# EAGLE design PowerSupply (EAGLE 6.5.0)
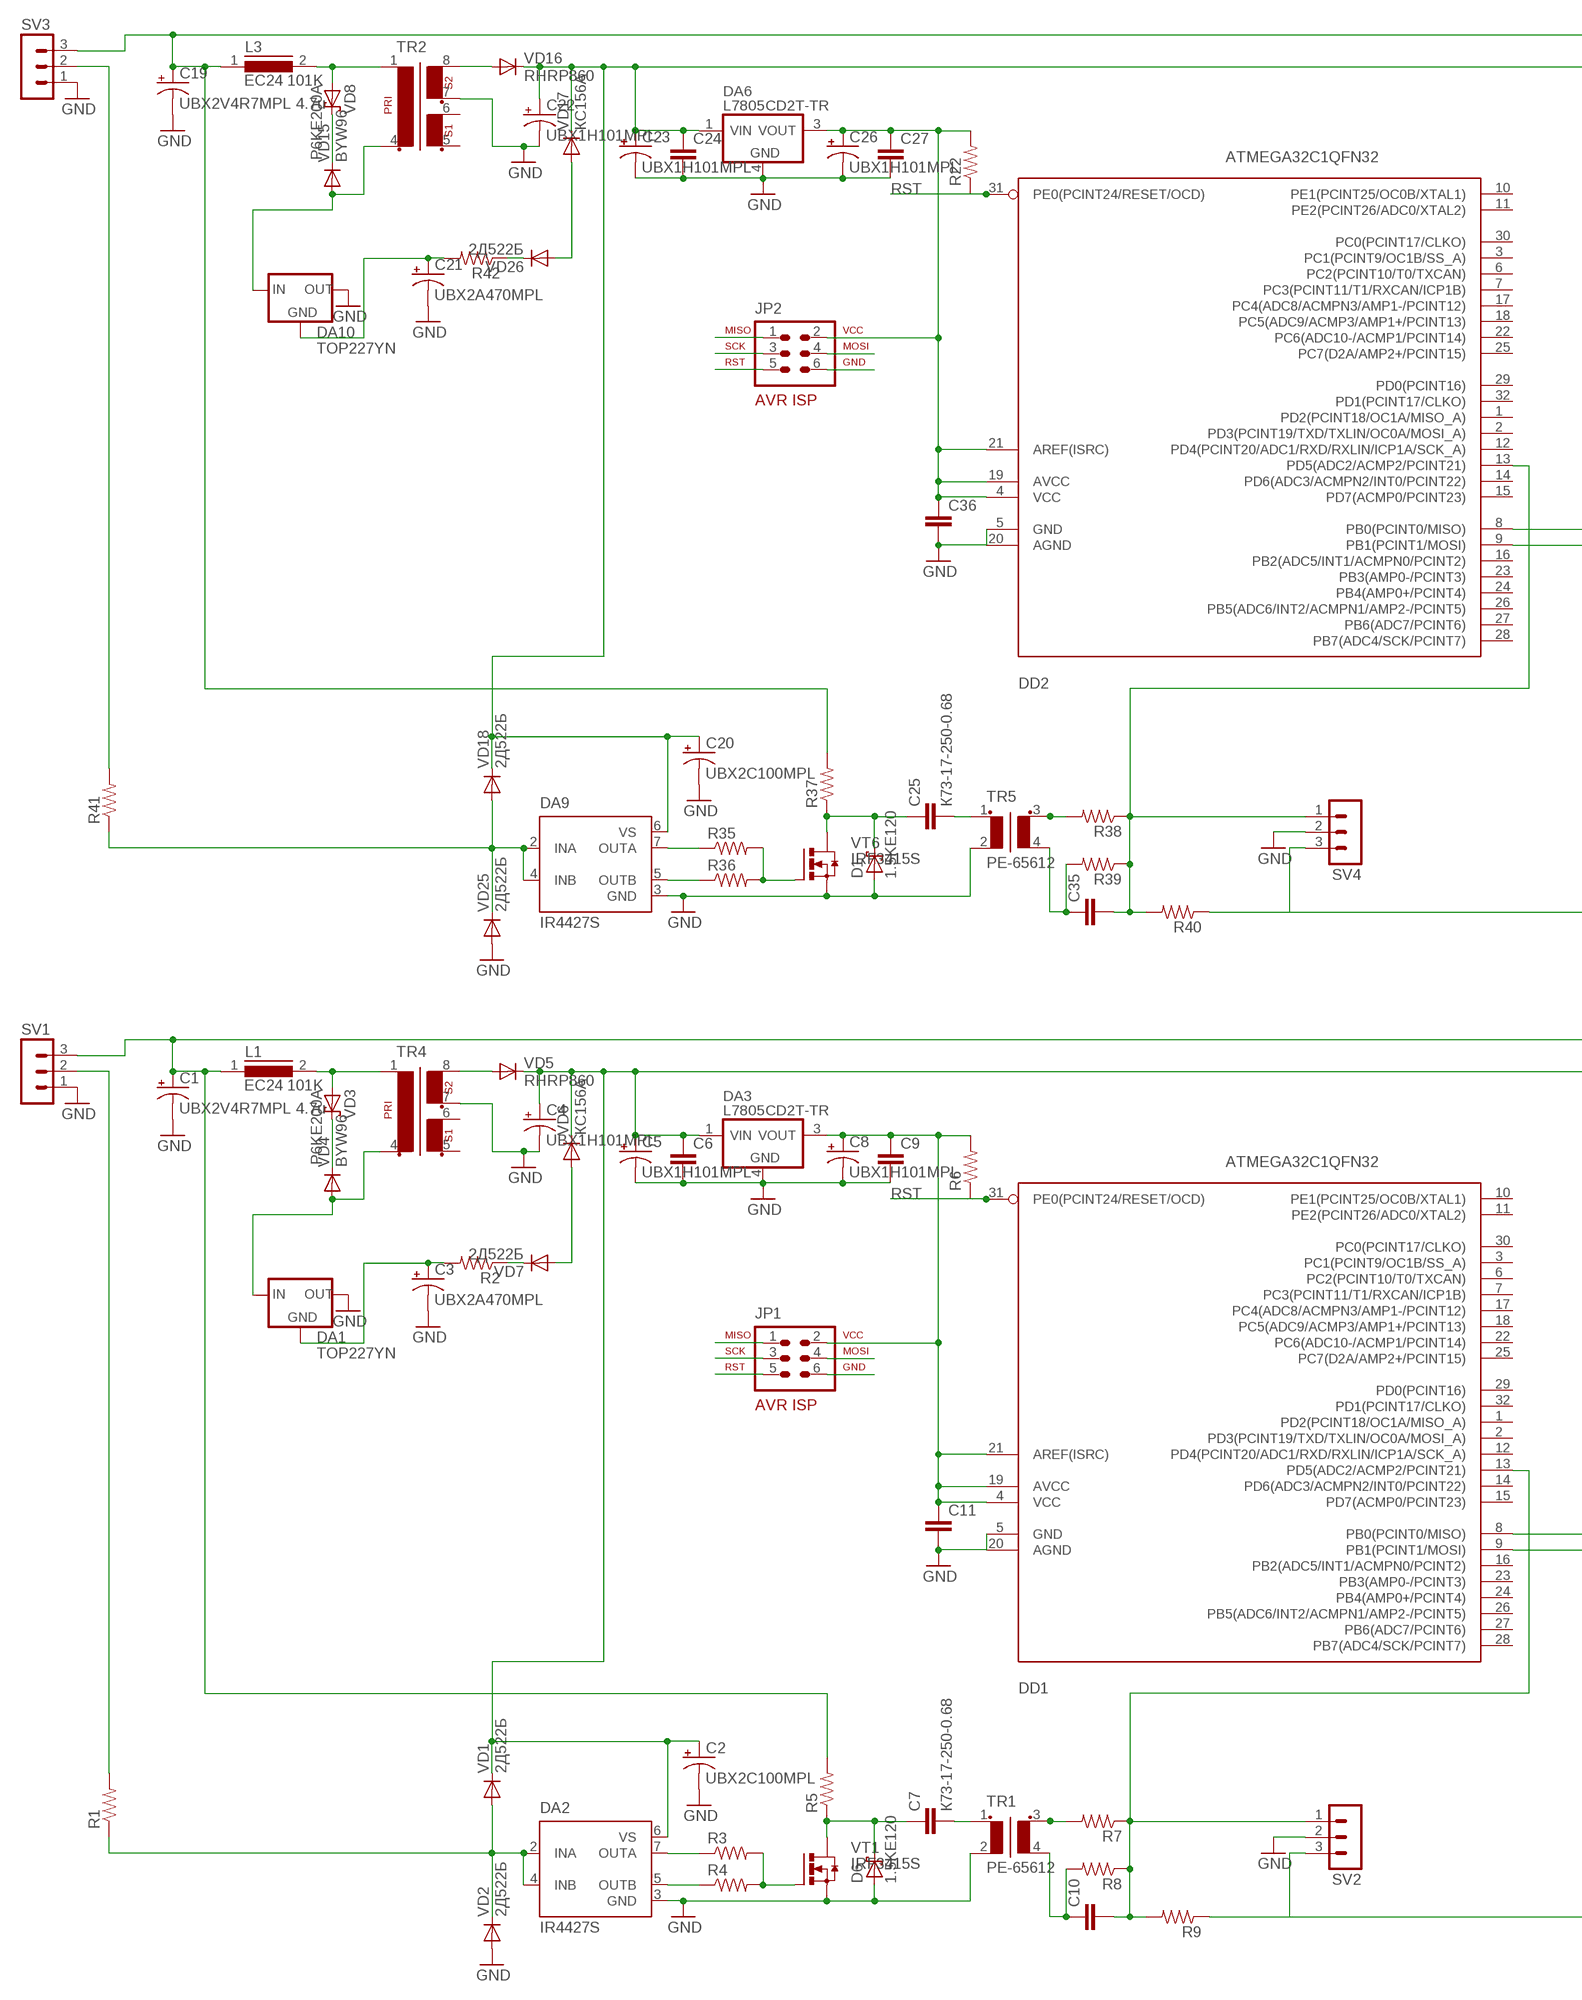
[diagram p0: schematic, sheet 1, part 1 of 2]
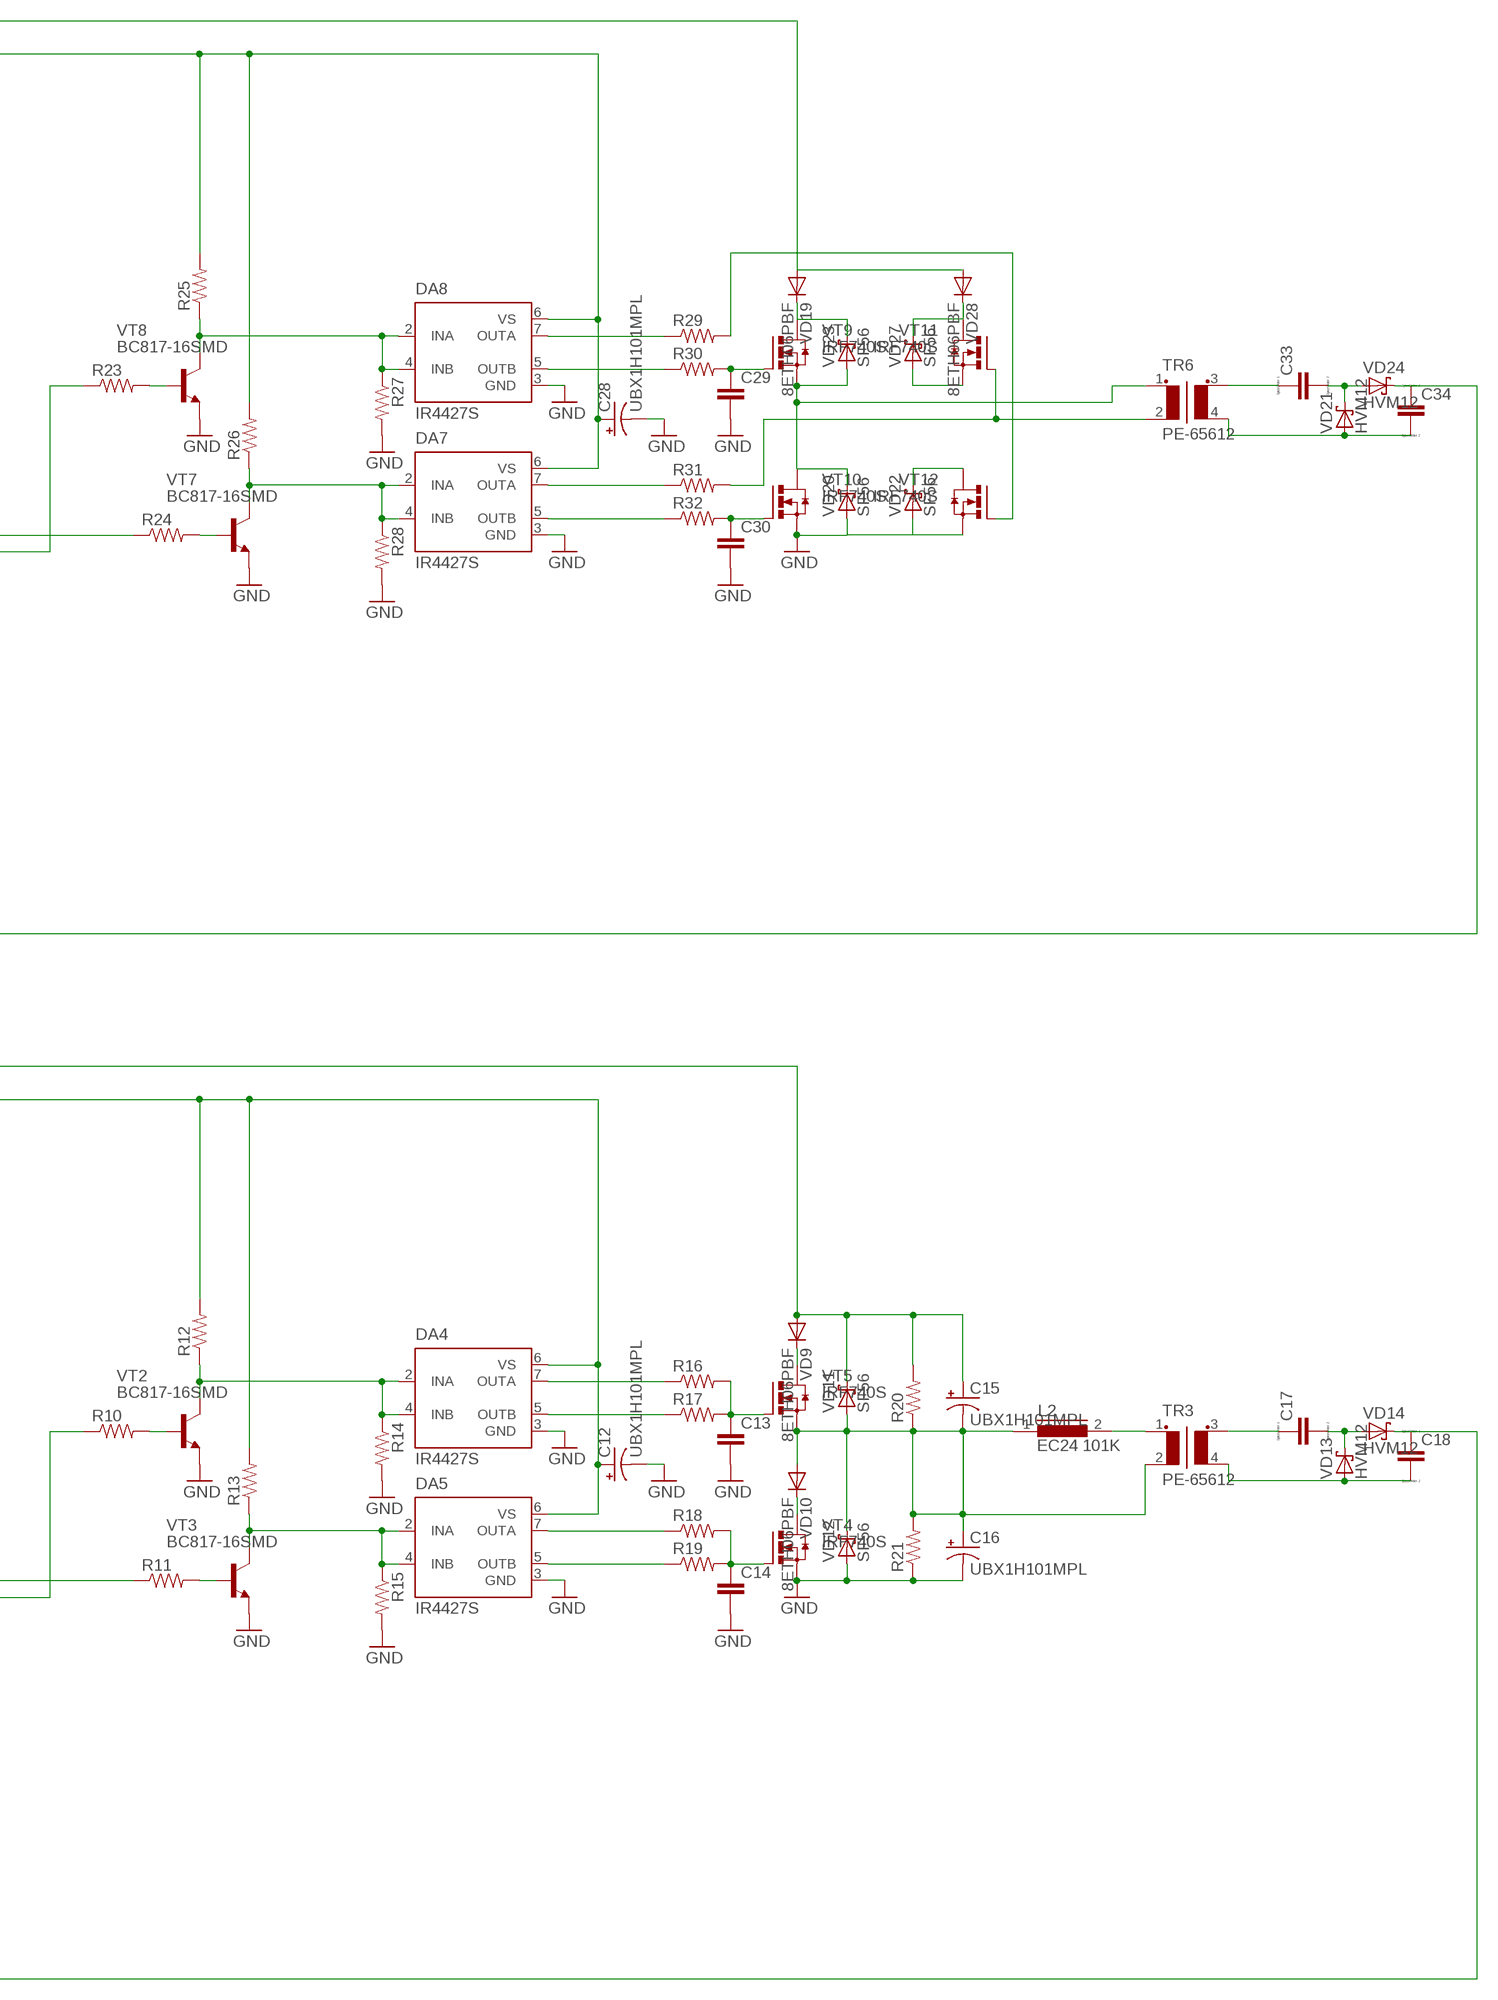
[diagram p1: schematic, sheet 1, part 2 of 2]

## Parts
C1  UBX2V4R7MPL 4.7u  CAP_POLPTH1  [CPOL-RADIAL-100UF-25V]
C2  UBX2C100MPL  CAP_POLPTH1  [CPOL-RADIAL-100UF-25V]
C3  UBX2A470MPL  CAP_POLPTH1  [CPOL-RADIAL-100UF-25V]
C4  UBX1H101MPL  CAP_POLPTH1  [CPOL-RADIAL-100UF-25V]
C5  UBX1H101MPL  CAP_POLPTH1  [CPOL-RADIAL-100UF-25V]
C6  CAP1206  [1206]
C7  К73-17-250-0.68  CAPPTH3  [CAP-PTH-LARGE]
C8  UBX1H101MPL  CAP_POLPTH1  [CPOL-RADIAL-100UF-25V]
C9  CAP1206  [1206]
C10  CAP1206  [1206]
C11  CAP1206  [1206]
C12  UBX1H101MPL  CAP_POLPTH1  [CPOL-RADIAL-100UF-25V]
C13  CAP1206  [1206]
C14  CAP1206  [1206]
C15  UBX1H101MPL  CAP_POLPTH1  [CPOL-RADIAL-100UF-25V]
C16  UBX1H101MPL  CAP_POLPTH1  [CPOL-RADIAL-100UF-25V]
C17  CC1812  [C1812]
C18  CC1812  [C1812]
C19  UBX2V4R7MPL 4.7u  CAP_POLPTH1  [CPOL-RADIAL-100UF-25V]
C20  UBX2C100MPL  CAP_POLPTH1  [CPOL-RADIAL-100UF-25V]
C21  UBX2A470MPL  CAP_POLPTH1  [CPOL-RADIAL-100UF-25V]
C22  UBX1H101MPL  CAP_POLPTH1  [CPOL-RADIAL-100UF-25V]
C23  UBX1H101MPL  CAP_POLPTH1  [CPOL-RADIAL-100UF-25V]
C24  CAP1206  [1206]
C25  К73-17-250-0.68  CAPPTH3  [CAP-PTH-LARGE]
C26  UBX1H101MPL  CAP_POLPTH1  [CPOL-RADIAL-100UF-25V]
C27  CAP1206  [1206]
C28  UBX1H101MPL  CAP_POLPTH1  [CPOL-RADIAL-100UF-25V]
C29  CAP1206  [1206]
C30  CAP1206  [1206]
C33  CC1812  [C1812]
C34  CC1812  [C1812]
C35  CAP1206  [1206]
C36  CAP1206  [1206]
D1  1.5KE120  P6KEXX  [CB417-15]
D6  1.5KE120  P6KEXX  [CB417-15]
DA1  TOP227YN  LM1086TO220V  [TO220S]
DA2  IR4427S  [SO08]
DA3  L7805CD2T-TR  MC7805D2T  [D2PAK-3]
DA4  IR4427S  [SO08]
DA5  IR4427S  [SO08]
DA6  L7805CD2T-TR  MC7805D2T  [D2PAK-3]
DA7  IR4427S  [SO08]
DA8  IR4427S  [SO08]
DA9  IR4427S  [SO08]
DA10  TOP227YN  LM1086TO220V  [TO220S]
DD1  ATMEGA32C1QFN32  [QFN32]
DD2  ATMEGA32C1QFN32  [QFN32]
JP1  AVR-ISP-6VERT  [AVR-ISP-6]
JP2  AVR-ISP-6VERT  [AVR-ISP-6]
L1  EC24 101K  MMICC7  [MMICC7]
L2  EC24 101K  MMICC7  [MMICC7]
L3  EC24 101K  MMICC7  [MMICC7]
R1  RESISTOR1206  [1206]
R2  RESISTOR1206  [1206]
R3  RESISTOR1206  [1206]
R4  RESISTOR1206  [1206]
R5  RESISTOR1206  [1206]
R6  RESISTOR1206  [1206]
R7  RESISTOR1206  [1206]
R8  RESISTOR1206  [1206]
R9  RESISTOR1206  [1206]
R10  RESISTOR1206  [1206]
R11  RESISTOR1206  [1206]
R12  RESISTOR1206  [1206]
R13  RESISTOR1206  [1206]
R14  RESISTOR1206  [1206]
R15  RESISTOR1206  [1206]
R16  RESISTOR1206  [1206]
R17  RESISTOR1206  [1206]
R18  RESISTOR1206  [1206]
R19  RESISTOR1206  [1206]
R20  RESISTOR1206  [1206]
R21  RESISTOR1206  [1206]
R22  RESISTOR1206  [1206]
R23  RESISTOR1206  [1206]
R24  RESISTOR1206  [1206]
R25  RESISTOR1206  [1206]
R26  RESISTOR1206  [1206]
R27  RESISTOR1206  [1206]
R28  RESISTOR1206  [1206]
R29  RESISTOR1206  [1206]
R30  RESISTOR1206  [1206]
R31  RESISTOR1206  [1206]
R32  RESISTOR1206  [1206]
R35  RESISTOR1206  [1206]
R36  RESISTOR1206  [1206]
R37  RESISTOR1206  [1206]
R38  RESISTOR1206  [1206]
R39  RESISTOR1206  [1206]
R40  RESISTOR1206  [1206]
R41  RESISTOR1206  [1206]
R42  RESISTOR1206  [1206]
SV1  MA03-1  [MA03-1]
SV2  MA03-1  [MA03-1]
SV3  MA03-1  [MA03-1]
SV4  MA03-1  [MA03-1]
TR1  PE-65612  [PE-65612]
TR2  EE20-2  [EE20-2]
TR3  PE-65612  [PE-65612]
TR4  EE20-2  [EE20-2]
TR5  PE-65612  [PE-65612]
TR6  PE-65612  [PE-65612]
VD1  2Д522Б  1N4446  [DO35-10]
VD2  2Д522Б  1N4446  [DO35-10]
VD3  P6KE200A  P6KEXX  [CB417-15]
VD4  BYW96  [SOD64-10]
VD5  RHRP860  DIODE-TO220V  [TO220ACS]
VD6  КС156А  1N4446  [DO35-10]
VD7  2Д522Б  1N4446  [DO35-10]
VD8  P6KE200A  P6KEXX  [CB417-15]
VD9  8ETH06PBF  DIODE-TO220V  [TO220ACS]
VD10  8ETH06PBF  DIODE-TO220V  [TO220ACS]
VD11  SF56  P6KEXX  [CB417-15]
VD12  SF56  P6KEXX  [CB417-15]
VD13  HVM12  P6KEXX  [CB417-15]
VD14  HVM12  P6KEXX  [CB417-15]
VD15  BYW96  [SOD64-10]
VD16  RHRP860  DIODE-TO220V  [TO220ACS]
VD17  КС156А  1N4446  [DO35-10]
VD18  2Д522Б  1N4446  [DO35-10]
VD19  8ETH06PBF  DIODE-TO220V  [TO220ACS]
VD20  SF56  P6KEXX  [CB417-15]
VD21  HVM12  P6KEXX  [CB417-15]
VD22  SF56  P6KEXX  [CB417-15]
VD23  SF56  P6KEXX  [CB417-15]
VD24  HVM12  P6KEXX  [CB417-15]
VD25  2Д522Б  1N4446  [DO35-10]
VD26  2Д522Б  1N4446  [DO35-10]
VD27  SF56  P6KEXX  [CB417-15]
VD28  8ETH06PBF  DIODE-TO220V  [TO220ACS]
VT1  IRF3415S  IRF3704S  [D2PACK]
VT2  BC817-16SMD  [SOT23-BEC]
VT3  BC817-16SMD  [SOT23-BEC]
VT4  IRF740S  IRF3704S  [D2PACK]
VT5  IRF740S  IRF3704S  [D2PACK]
VT6  IRF3415S  IRF3704S  [D2PACK]
VT7  BC817-16SMD  [SOT23-BEC]
VT8  BC817-16SMD  [SOT23-BEC]
VT9  IRF740S  IRF3704S  [D2PACK]
VT10  IRF740S  IRF3704S  [D2PACK]
VT11  IRF740S  IRF3704S  [D2PACK]
VT12  IRF740S  IRF3704S  [D2PACK]

## Nets
GND: C1.2(-) C2.2(-) C3.2(-) C4.2(-) C5.2(-) C6.2 C8.2(-) C9.2 C11.2 C12.2(-) C13.2 C14.2 C16.2(-) C19.2(-) C20.2(-) C21.2(-) C22.2(-) C23.2(-) C24.2 C26.2(-) C27.2 C28.2(-) C29.2 C30.2 C36.2 D1.A D6.A DA1.2(OUT) DA2.3(GND) DA3.4(GND) DA4.3(GND) DA5.3(GND) DA6.4(GND) DA7.3(GND) DA8.3(GND) DA9.3(GND) DA10.2(OUT) DD1.5(GND) DD1.20(AGND) DD2.5(GND) DD2.20(AGND) JP1.6 JP2.6 R14.2 R15.2 R21.1 R27.2 R28.2 SV1.1 SV2.2 SV3.1 SV4.2 TR1.2 TR2.7 TR4.7 TR5.2 VD2.A VD12.A VD20.A VD22.A VD25.A VT1.3(S) VT2.E VT3.E VT4.3(S) VT6.3(S) VT7.E VT8.E VT10.3(S) VT12.3(S)
MISO: DD1.8(PB0(PCINT0/MISO)) JP1.1 R11.1
MISO1: DD2.8(PB0(PCINT0/MISO)) JP2.1 R24.1
MOSI: DD1.9(PB1(PCINT1/MOSI)) JP1.4 R10.1
MOSI1: DD2.9(PB1(PCINT1/MOSI)) JP2.4 R23.1
N$1: TR4.8 VD5.A
N$2: TR2.8 VD16.A
N$3: DA5.2(INA) DA5.4(INB) R13.1 R15.1 VT3.C
N$4: DA4.2(INA) DA4.4(INB) R12.1 R14.1 VT2.C
N$5: C17.2 VD13.C VD14.A
N$6: C18.1 R9.1 SV2.3 VD14.C
N$7: R10.2 VT2.B
N$8: R11.2 VT3.B
N$9: DA5.7(OUTA) R18.1
N$10: DA5.5(OUTB) R19.1
N$11: DA4.5(OUTB) R17.1
N$12: DA4.7(OUTA) R16.1
N$13: C14.1 R18.2 R19.2 VT4.1(G)
N$14: C13.1 R16.2 R17.2 VT5.1(G)
N$15: C18.2 TR3.4(S2) VD13.A
N$16: C17.1 TR3.3(S1)
N$17: VD9.C VT5.2(D)
N$18: DA1.3(IN) TR4.4 VD4.A
N$19: DA2.5(OUTB) R4.1
N$20: C15.2(-) C16.1(+) L2.1 R20.1 R21.2 TR3.2 VD10.A VD11.A VD12.C VT5.3(S)
N$21: L2.2 TR3.1
N$22: VD10.C VT4.2(D)
N$23: DA2.7(OUTA) R3.1
N$24: DA7.2(INA) DA7.4(INB) R26.1 R28.1 VT7.C
N$25: DA8.2(INA) DA8.4(INB) R25.1 R27.1 VT8.C
N$26: R3.2 R4.2 VT1.1(G)
N$27: R2.1 VD7.C
N$28: C2.1(+) C4.1(+) C5.1(+) C6.1 C12.1(+) DA2.6(VS) DA3.1(VIN) DA4.6(VS) DA5.6(VS) R12.2 R13.2 VD1.C VD5.C VD6.C
N$29: DA2.2(INA) DA2.4(INB) R1.1 VD1.A VD2.C
N$30: C7.1 D6.C R5.1 VT1.2(D)
N$31: C10.1 R8.2 TR1.4(S2)
N$32: C7.2 TR1.1
N$33: R7.2 TR1.3(S1)
N$34: C10.2 DD1.13(PD5(ADC2/ACMP2/PCINT21)) R7.1 R8.1 R9.2 SV2.1
N$35: C3.1(+) DA1.1(GND) R2.2
N$36: R1.2 SV1.2
N$37: L1.2 TR4.1 VD3.A
N$38: VD3.C VD4.C
N$39: C1.1(+) C15.1(+) L1.1 R5.2 R20.2 SV1.3 VD9.A VD11.C
N$40: R23.2 VT8.B
N$41: VD6.A VD7.A
N$42: R24.2 VT7.B
N$43: DA7.7(OUTA) R31.1
N$44: DA7.5(OUTB) R32.1
N$45: DA8.5(OUTB) R30.1
N$46: DA8.7(OUTA) R29.1
N$47: C30.1 R32.2 VT10.1(G)
N$48: C29.1 R30.2 VT9.1(G)
N$49: C33.2 VD21.C VD24.A
N$50: C34.1 R40.1 SV4.3 VD24.C
N$51: C34.2 TR6.4(S2) VD21.A
N$52: C33.1 TR6.3(S1)
N$54: TR6.1 VD20.C VD23.A VT9.3(S) VT10.2(D)
N$56: VD19.C VD23.C VT9.2(D)
N$57: C20.1(+) C22.1(+) C23.1(+) C24.1 C28.1(+) DA6.1(VIN) DA7.6(VS) DA8.6(VS) DA9.6(VS) R25.2 R26.2 VD16.C VD17.C VD18.C
N$58: DA9.2(INA) DA9.4(INB) R41.1 VD18.A VD25.C
N$59: DA9.5(OUTB) R36.1
N$60: DA9.7(OUTA) R35.1
N$61: R35.2 R36.2 VT6.1(G)
N$62: C25.1 D1.C R37.1 VT6.2(D)
N$63: C35.1 R39.2 TR5.4(S2)
N$64: C25.2 TR5.1
N$65: R38.2 TR5.3(S1)
N$66: C35.2 DD2.13(PD5(ADC2/ACMP2/PCINT21)) R38.1 R39.1 R40.2 SV4.1
N$67: L3.2 TR2.1 VD8.A
N$68: VD8.C VD15.C
N$69: C19.1(+) L3.1 R37.2 SV3.3 VD19.A VD28.A
N$70: R41.2 SV3.2
N$71: DA10.3(IN) TR2.4 VD15.A
N$72: R42.1 VD26.C
N$73: C21.1(+) DA10.1(GND) R42.2
N$74: VD17.A VD26.A
N$76: VD27.C VD28.C VT11.2(D)
N$77: VD27.A VT11.3(S)
N$78: VD22.C VT12.2(D)
N$80: R29.2 VT12.1(G)
N$81: R31.2 TR6.2 VT11.1(G)
RST: DD1.31(PE0(PCINT24/RESET/OCD)) DD2.31(PE0(PCINT24/RESET/OCD)) JP1.5 JP2.5 R6.1 R22.1
SCK: JP1.3
SCK1: JP2.3
VOUT: C8.1(+) C9.1 C11.1 C26.1(+) C27.1 C36.1 DA3.3(VOUT) DA6.3(VOUT) DD1.4(VCC) DD1.19(AVCC) DD1.21(AREF(ISRC)) DD2.4(VCC) DD2.19(AVCC) DD2.21(AREF(ISRC)) JP1.2 JP2.2 R6.2 R22.2
Unconnected: DD1.1(PD2(PCINT18/OC1A/MISO_A)) DD1.2(PD3(PCINT19/TXD/TXLIN/OC0A/MOSI_A)) DD1.3(PC1(PCINT9/OC1B/SS_A)) DD1.6(PC2(PCINT10/T0/TXCAN)) DD1.7(PC3(PCINT11/T1/RXCAN/ICP1B)) DD1.10(PE1(PCINT25/OC0B/XTAL1)) DD1.11(PE2(PCINT26/ADC0/XTAL2)) DD1.12(PD4(PCINT20/ADC1/RXD/RXLIN/ICP1A/SCK_A)) DD1.14(PD6(ADC3/ACMPN2/INT0/PCINT22)) DD1.15(PD7(ACMP0/PCINT23)) DD1.16(PB2(ADC5/INT1/ACMPN0/PCINT2)) DD1.17(PC4(ADC8/ACMPN3/AMP1-/PCINT12)) DD1.18(PC5(ADC9/ACMP3/AMP1+/PCINT13)) DD1.22(PC6(ADC10-/ACMP1/PCINT14)) DD1.23(PB3(AMP0-/PCINT3)) DD1.24(PB4(AMP0+/PCINT4)) DD1.25(PC7(D2A/AMP2+/PCINT15)) DD1.26(PB5(ADC6/INT2/ACMPN1/AMP2-/PCINT5)) DD1.27(PB6(ADC7/PCINT6)) DD1.28(PB7(ADC4/SCK/PCINT7)) DD1.29(PD0(PCINT16)) DD1.30(PC0(PCINT17/CLKO)) DD1.32(PD1(PCINT17/CLKO)) DD2.1(PD2(PCINT18/OC1A/MISO_A)) DD2.2(PD3(PCINT19/TXD/TXLIN/OC0A/MOSI_A)) DD2.3(PC1(PCINT9/OC1B/SS_A)) DD2.6(PC2(PCINT10/T0/TXCAN)) DD2.7(PC3(PCINT11/T1/RXCAN/ICP1B)) DD2.10(PE1(PCINT25/OC0B/XTAL1)) DD2.11(PE2(PCINT26/ADC0/XTAL2)) DD2.12(PD4(PCINT20/ADC1/RXD/RXLIN/ICP1A/SCK_A)) DD2.14(PD6(ADC3/ACMPN2/INT0/PCINT22)) DD2.15(PD7(ACMP0/PCINT23)) DD2.16(PB2(ADC5/INT1/ACMPN0/PCINT2)) DD2.17(PC4(ADC8/ACMPN3/AMP1-/PCINT12)) DD2.18(PC5(ADC9/ACMP3/AMP1+/PCINT13)) DD2.22(PC6(ADC10-/ACMP1/PCINT14)) DD2.23(PB3(AMP0-/PCINT3)) DD2.24(PB4(AMP0+/PCINT4)) DD2.25(PC7(D2A/AMP2+/PCINT15)) DD2.26(PB5(ADC6/INT2/ACMPN1/AMP2-/PCINT5)) DD2.27(PB6(ADC7/PCINT6)) DD2.28(PB7(ADC4/SCK/PCINT7)) DD2.29(PD0(PCINT16)) DD2.30(PC0(PCINT17/CLKO)) DD2.32(PD1(PCINT17/CLKO)) TR2.5 TR2.6 TR4.5 TR4.6

## Library data of the parts
C1-C5 C8 C12 C15 C16 C19-C23 C26 C28 = SparkFun-Capacitors:CAP_POL: Capacitor Polarized These are standard SMD and PTH capacitors. Normally 10uF, 47uF, and 100uF in electrolytic and tantalum varieties. Always verify the external diameter of the through hole cap, it varies with capacity, voltage, and manufacturer. The EIA devices should be standard.
C6 C7 C9-C11 C13 C14 C24 C25 C27 C29 C30 C35 C36 = SparkFun-Capacitors:CAP: Capacitor Standard 0603 ceramic capacitor, and 0.1" leaded capacitor.
C17 C18 C33 C34 = eagle-ltspice:C: CAPACITOR, European symbol; SPICEMODEL: NONE; SPICEPREFIX: C
D1 D6 VD3 VD8 VD11-VD14 VD20-VD24 VD27 = diode:P6KEXX: DIODE transient-voltage suppressor
DA1 DA10 = v-reg-3:LM1086
DA2 DA4 DA5 DA7-DA9 = ir:IR4427: DUAL LOW SIDE DRIVER Source: ID4426.pdf; MF: INTERNATIONAL RECTIFIER(IR); MPN: IR4427STRPBF; OC_FARNELL: 8639094; OC_NEWARK: 63J7933
DA3 DA6 = _hhn_78xx_79xx_NCV78xx_d2pak_dpak:MC78*: 78xx SMD (D2PAK, DPAK) (MC)78xx..DT (DPAK-3; Rth,JA = 92 K/W) (MC)78xx..D2T (D2PAK-3; Rth,JA = 45 K/W @ 10x10mm copper area) Linear Voltage Regulators, Positive, 1 A (ON Semiconductor) Package dimenisions and soldering footprints acc. to ONSEMI specs. Source: http://onsemi.com Datasheet document#: MC7800/D Technologies: 78xxyD(2)Tz: xx = Output Voltage (V) y, z: additional suffixes see manufacturer's datasheet Author: Dipl.-Ing. FH Rainer Bayer HHN Hochschule Heilbronn, rainer.bayer@hs-heilbronn.de Ingenieurbüro ing-rb, mail@ing-rb.de
DD1 DD2 = Power_Supply:ATMEGA32C1
JP1 JP2 = avr-7:AVR-ISP-6: AVR ISP-6 Serial Programming Header
L1-L3 = inductors:MMICC7: INDUCTOR
R1-R32 R35-R42 = SparkFun-Passives:RESISTOR: Resistor Basic schematic elements and footprints for 0603, 1206, and PTH resistors.
SV1-SV4 = con-lstb:MA03-1: PIN HEADER; OC_FARNELL: unknown; OC_NEWARK: unknown
TR1 TR3 TR5 TR6 = transformer-pulse:PE-65612: TRANSFORMERS FOR DIGITAL AUDIO DATA TRANSMISSION Source: Data sheet <http://ww2.pulseeng.com/products/datasheets/T601.pdf> www.pulseeng.com
TR2 TR4 = trafo:EE20-2: TRANSFORMER 1 primary winding, 2 secondary windings ERA
VD1 VD2 VD6 VD7 VD17 VD18 VD25 VD26 = diode:1N4446: DIODE high speed (Philips)
VD4 VD15 = diode:BYW96: DIODE fast soft-recovery rectifier
VD5 VD9 VD10 VD16 VD19 VD28 = diode:DIODE-: DIODE
VT1 VT4-VT6 VT9-VT12 = transistor-power:IRF3704: SMPS MOSFET HEXFET® Power MOSFET Source: http://www.irf.com/product-info/datasheets/data/irf3704.pdf
VT2 VT3 VT7 VT8 = transistor-npn:BC817*: NPN Transistor

## Board
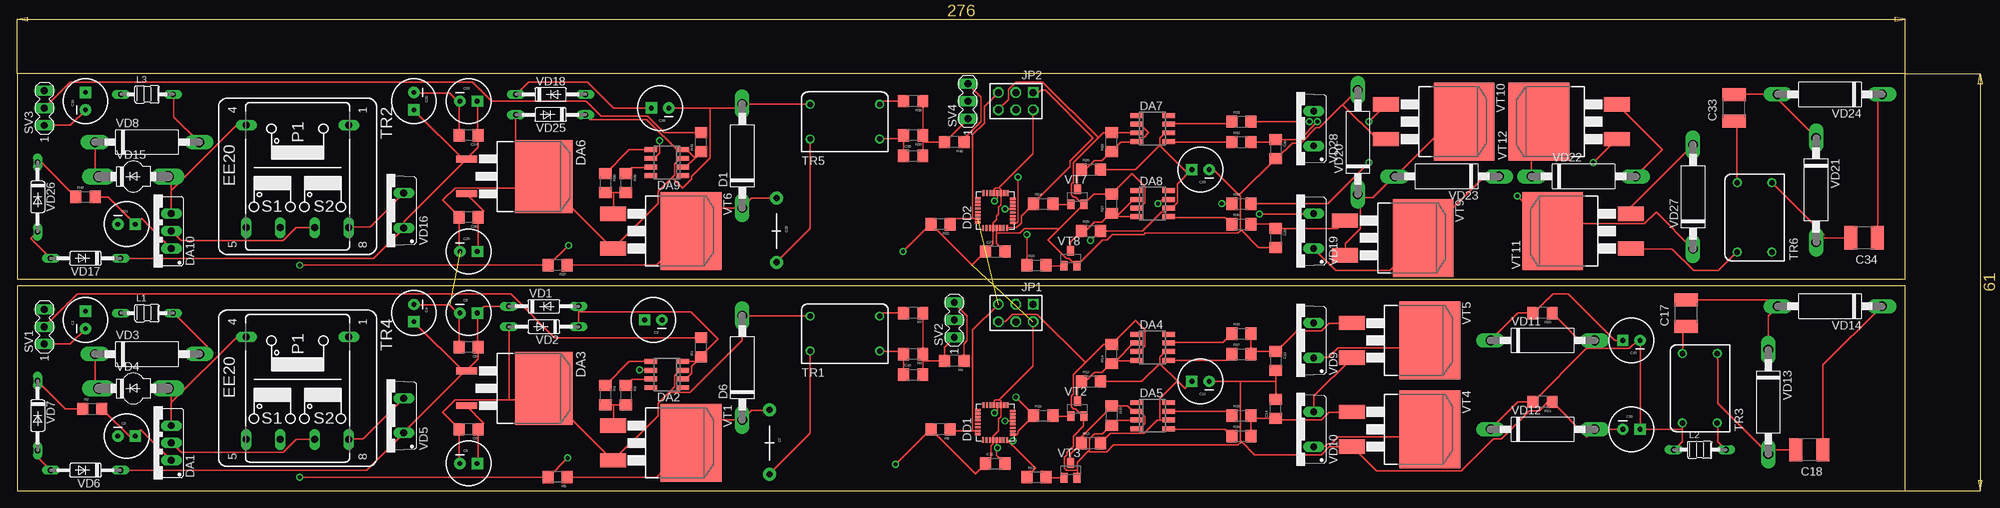
[diagram p2: board, top side]
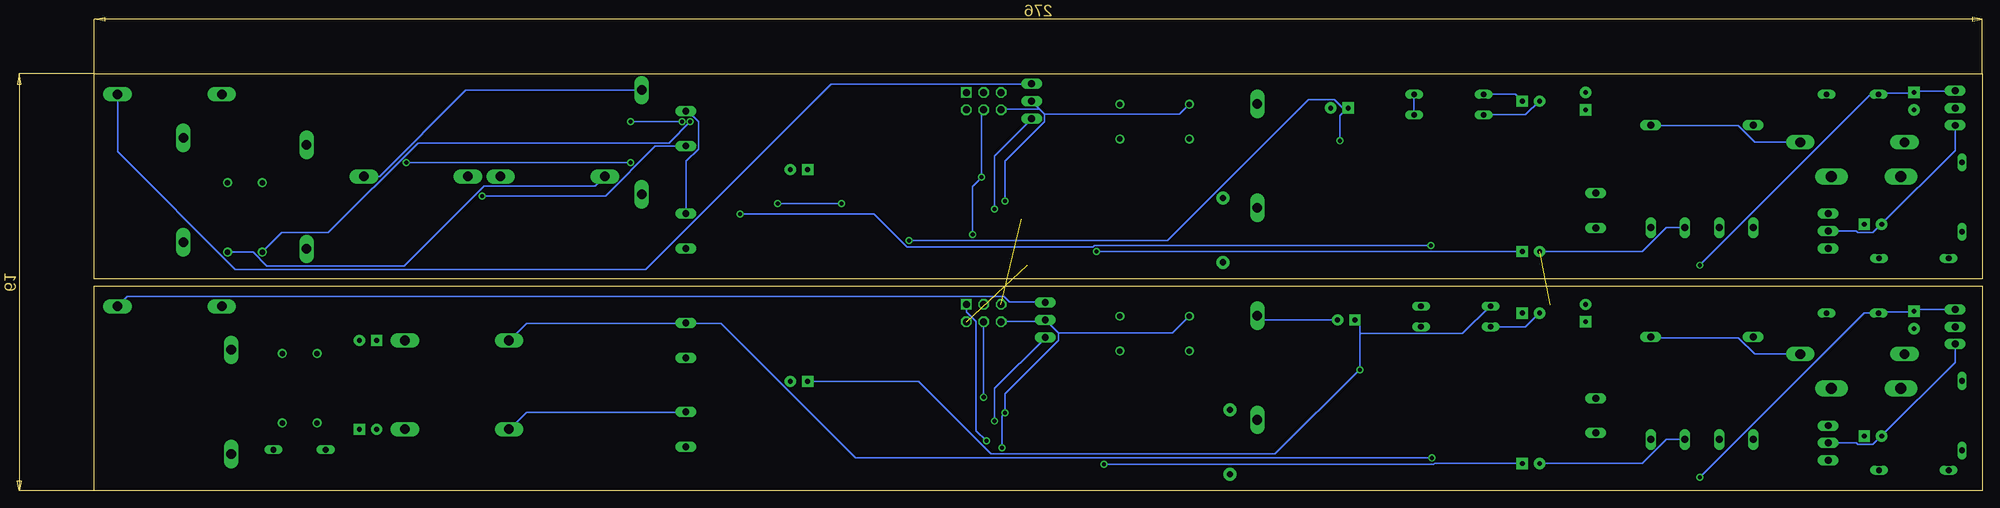
[diagram p3: board, bottom side, seen from below]

Size 276 x 61 mm. Coordinates in mm from the lower left corner, seen from the top.
Outline: 0,0 276,0 276,30 0,30 0,0
Outline: 0,31 276,31 276,61 0,61 0,31
Copper layers (1*16): Top 0.035mm / dielectric 1.5mm / Bottom 0.035mm
Design rules "default *": minimum track width 10mil, minimum drill 24mil, track to track 7mil, track to pad 7mil, pad to pad 8mil, via to via 7mil, smd to smd 7mil, copper to edge 40mil, drill to drill 8mil, minimum pad ring 10mil, minimum via ring 8mil, stop-mask expansion 4mil, vias tented up to drill 0mil, thermal gap 10mil

### Footprints (pad centres in the part's own frame; a part is rotated, then mirrored left to right if it is on the bottom)
CPOL-RADIAL-100UF-25V = drill 0.7 pad 1.651 square: 1 1.27,0 | drill 0.7 pad 1.651: 2 -1.27,0
1206 = smd 1.6 x 1.8: 1 -1.4,0; 2 1.4,0
CAP-PTH-LARGE = drill 0.9 pad 1.905: 1 -4.826,0; 2 4.572,0
C1812 = smd 1.9 x 3.4: 1 -1.95,0; 2 1.95,0
CB417-15 = drill 1.397 long: A 7.62,0; C -7.62,0
TO220S = drill 1.016 long: 1 -2.54,-2.54; 2 0,-2.54; 3 2.54,-2.54
SO08 = smd 0.72 x 1.78: 1 -1.905,-2.35; 2 -0.635,-2.35; 3 0.635,-2.35; 4 1.905,-2.35; 5 1.905,2.35; 6 0.635,2.35; 7 -0.635,2.35; 8 -1.905,2.35
D2PAK-3 = smd 1.016 x 3.05: 1 -2.54,-11.31; 3 2.54,-11.31 | smd 10.66 x 8.38: 4 0,0
QFN32 = smd 0.813 x 0.33: 1 -2.56,1.79; 2 -2.56,1.29; 3 -2.56,0.79; 4 -2.56,0.29; 5 -2.56,-0.21; 6 -2.56,-0.71; 7 -2.56,-1.21; 8 -2.56,-1.71; 17 2.56,-1.79; 18 2.56,-1.29; 19 2.56,-0.79; 20 2.56,-0.29; 21 2.56,0.21; 22 2.56,0.71; 23 2.56,1.21; 24 2.56,1.71 | smd 0.33 x 0.813: 9 -1.79,-2.56; 10 -1.29,-2.56; 11 -0.79,-2.56; 12 -0.29,-2.56; 13 0.21,-2.56; 14 0.71,-2.56; 15 1.21,-2.56; 16 1.71,-2.56; 25 1.79,2.56; 26 1.29,2.56; 27 0.79,2.56; 28 0.29,2.56; 29 -0.21,2.56; 30 -0.71,2.56; 31 -1.21,2.56; 32 -1.71,2.56
AVR-ISP-6 = drill 1.016 square: 1 -2.54,-1.27 | drill 1.016 octagon: 2 -2.54,1.27; 3 0,-1.27; 4 0,1.27; 5 2.54,-1.27; 6 2.54,1.27
MMICC7 = drill 0.813 long: 1 -3.81,0; 2 3.81,0
MA03-1 = drill 1.016 long: 1 -2.54,0; 2 0,0; 3 2.54,0
PE-65612 = drill 0.8 pad 1.27: 1 -5.08,-2.54; 2 -5.08,2.54; 3 5.08,2.54; 4 5.08,-2.54
EE20-2 = drill 1.016 long: 1 -7.493,7.493; 4 -7.493,-7.493; 5 7.493,-7.493; 6 7.493,-2.515; 7 7.493,2.515; 8 7.493,7.493
DO35-10 = drill 0.813 long: A 5.08,0; C -5.08,0
SOD64-10 = drill 1.6 long: A 5.08,0; C -5.08,0
TO220ACS = drill 1.016 long: A 2.54,-2.54; C -2.54,-2.54
D2PACK = smd 2.083 x 3.81: 1 -2.54,-8.89; 3 2.54,-8.89 | smd 11.43 x 8.89: 2 0,2.54
SOT23-BEC = smd 1 x 1.4: B -0.95,-1.1; C 0,1.1; E 0.95,-1.1

### Placement (x,y rotation side)
C1  10,25 90 top
C2  93,25 180 top
C3  16,8 0 top
C4  58,26 270 top
C5  66,26 0 top
C6  66,21 180 top
C7  110,7 270 top
C8  66,4 0 top
C9  66,9 180 top
C10  131,17 0 top
C11  143,4 0 top
C12  173,16 180 top
C13  184,19 270 top
C14  184,12 90 top
C15  236,22 180 top
C16  236,9 0 top
C17  244,26 90 top
C18  262,6 180 top
C19  10,57 90 top
C20  58,57 270 top
C21  16,39 0 top
C22  66,57 0 top
C23  173,47 180 top
C24  66,52 180 top
C25  111,38 270 top
C26  66,35 0 top
C27  143,35 0 top
C28  94,56 180 top
C29  184,37 270 top
C30  184,50 270 top
C33  251,56 90 top
C34  270,37 180 top
C35  131,49 0 top
C36  66,40 180 top
D1  106,49 90 top
D6  106,18 90 top
DA1  20,7 90 top
DA2  95,17 90 top
DA3  77,15 270 top
DA4  166,21 270 top
DA5  166,11 270 top
DA6  77,46 270 top
DA7  166,53 270 top
DA8  166,42 270 top
DA9  95,48 90 top
DA10  20,38 90 top
DD1  143,10 90 top
DD2  143,41 90 top
JP1  146,26 180 top
JP2  146,57 180 top
L1  19,26 0 top
L2  246,6 0 top
L3  19,58 0 top
R1  100,21 90 top
R2  11,12 0 top
R3  89,14 270 top
R4  86,14 270 top
R5  79,2 180 top
R6  135,9 180 top
R7  131,26 180 top
R8  131,20 180 top
R9  137,19 180 top
R10  150,11 0 top
R11  149,2 0 top
R12  157,16 0 top
R13  157,7 0 top
R14  160,20 90 top
R15  160,11 270 top
R16  179,23 0 top
R17  179,20 0 top
R18  179,11 0 top
R19  179,8 0 top
R20  223,26 180 top
R21  223,13 180 top
R22  135,39 180 top
R23  149,33 0 top
R24  150,42 0 top
R25  157,38 0 top
R26  157,47 0 top
R27  160,42 90 top
R28  160,51 90 top
R29  179,42 0 top
R30  179,39 0 top
R31  179,54 0 top
R32  179,51 0 top
R35  89,45 270 top
R36  86,45 270 top
R37  79,33 180 top
R38  131,57 180 top
R39  131,52 180 top
R40  137,51 180 top
R41  100,51 90 top
R42  10,43 0 top
SV1  4,24 90 top
SV2  137,25 90 top
SV3  4,56 90 top
SV4  139,57 90 top
TR1  121,23 0 top
TR2  41,46 270 top
TR3  246,15 90 top
TR4  41,15 270 top
TR5  121,54 0 top
TR6  254,40 90 top
VD1  77,27 0 top
VD2  77,24 180 top
VD3  19,20 0 top
VD4  17,15 0 top
VD5  54,11 90 top
VD6  10,3 180 top
VD7  3,11 270 top
VD8  19,51 0 top
VD9  187,22 90 top
VD10  187,9 90 top
VD11  223,22 0 top
VD12  223,9 0 top
VD13  256,13 270 top
VD14  265,27 180 top
VD15  17,46 0 top
VD16  54,41 90 top
VD17  10,34 180 top
VD18  78,58 0 top
VD19  187,38 90 top
VD20  196,51 90 top
VD21  263,44 270 top
VD22  229,46 0 top
VD23  209,46 180 top
VD24  265,58 180 top
VD25  78,55 180 top
VD26  3,43 270 top
VD27  245,43 90 top
VD28  187,53 90 top
VT1  96,7 270 top
VT2  155,12 0 top
VT3  154,3 0 top
VT4  204,9 270 top
VT5  204,22 270 top
VT6  96,38 270 top
VT7  155,43 0 top
VT8  154,34 0 top
VT9  203,37 270 top
VT10  209,54 270 top
VT11  227,38 90 top
VT12  225,54 90 top

### Tracks (layer width: path | path; a pad name or v marks a point on that pad's centre or on a via)
GND  (via drill 0.61)  (1 unrouted)
  Top 0.254: C16.2 VD12.A 230.6,9 229.5,7.9 R21.1 223.8,13 222.5,11.7 221.1,11.7 217,7.6 215.8,7.6 211.1,2.9 198.7,2.9 195.2,6.4 VT4.3 195.1,6.4 191.8,6.4 190.7,5.3 180.9,5.3 179.05,7.15 | C13.2 184,16 | 184,16 C14.2 | C12.2 178.8,16 | 178.8,16 184,16 | 179.05,7.15 178.8,7.4 178.8,16 | SV1.1 4,21.5 7.8,21.5 10,23.7 C1.2 | TR4.7 40.8,7.5 38.9,5.6 24,5.6 22.6,7 DA1.2 | 143.2,6.3 143.2,5.2 C11.2 | 143.2,6.3 143.2,7.4 DD1.5 | v142.9,11.4 143.3,11.8 143.3,12.5 DD1.20 | v143.3,6.3 143.2,6.3 | 163.7,20.4 DA4.3 163.8,20.4 164.1,20.4 164.9,21.2 164.9,23.5 163.5,24.9 R14.2 158.8,21.4 156.15,18.75 | 163.7,10.4 DA5.3 163.6,10.3 160.8,10.3 160.1,9.6 R15.2 158.7,8.3 157.5,8.3 156.8,7.6 156.8,6 156.55,5.75 | 155,3 155,4.2 156.55,5.75 | 155,3 155,1.9 VT3.E | 155,3 153.4,3 153.1,3.3 153.1,4.9 153.5,5.3 153.5,5.6 154.4,6.5 154.4,8 155.9,9.5 155.9,10.9 VT2.E 155.8,10.9 154.7,12 154.4,12 154.1,12.3 154.1,13.9 154.4,14.2 154.4,17 156.15,18.75 | 156.15,18.75 149.1,25.8 145.5,25.8 144.5,24.8 143.5,24.8 JP1.6 | TR1.2 115.9,25.6 106,25.6 D6.A 106,22 98.4,14.4 95.4,14.4 95.35,14.45 | 97.4,17.6 DA2.3 97.3,17.6 96.9,17.6 96.1,16.8 96.1,15.2 95.35,14.45 | 95.35,14.45 93.7,12.8 93.7,11 87.2,4.5 VT1.3 87,4.5 76.8,14.7 DA3.4 75.3,13.3 71.9,13.3 | C6.2 64.6,25.9 64.7,26 C5.2 64.5,25.9 63.2,27.2 58,27.2 C4.2 | C8.2 64.7,4 64.6,4.1 C9.2 64.6,9.1 62.2,11.5 64,13.3 71.9,13.3 | 71.9,13.3 71.9,24 VD2.A | 179.05,7.15 179,7.1 178.9,7.1 178.5,6.7 160.3,6.7 159.3,5.7 156.6,5.7 156.55,5.75 | SV3.1 4,53.5 7.8,53.5 10,55.7 C19.2 | TR2.7 40.8,38.5 38.9,36.6 24,36.6 22.6,38 DA10.2 | 97.4,48.6 DA9.3 97.3,48.6 96.9,48.6 96.1,47.8 96.1,46.2 95.75,45.85
  Top 0.254: 95.75,45.85 93.7,43.8 93.7,42 87.2,35.5 VT6.3 87,35.5 76.8,45.7 DA6.4 | C24.2 64.6,56.9 64.7,57 C22.2 64.5,56.9 63.2,58.2 58,58.2 C20.2 | C26.2 64.7,35 64.6,35.1 C36.2 64.6,40.1 62.2,42.5 64,44.3 75.3,44.3 DA6.4 | VD25.A 72.9,55 72.9,44.4 DA6.4 | VT12.3 233.9,56.5 240.5,49.9 236.6,46 VD22.A | 193.85,56.45 193.8,56.5 196,58.7 VD20.A | 193.85,56.45 198.8,51.5 200.1,51.5 VT10.3 | C29.2 181.5,35.6 178.95,38.15 | 178.95,38.15 178.8,38.3 178.8,43.1 178.65,43.25 | 178.65,43.25 174.6,47.3 174.3,47 C23.2 | 178.65,43.25 C30.2 184.1,48.6 186.4,50.9 187.7,50.9 189.9,53.1 190.4,53.1 193.7,56.4 193.8,56.4 193.85,56.45 | 163.7,41.4 DA8.3 163.8,41.4 164.1,41.4 164.9,42.2 164.9,44.5 163,46.4 R27.2 157.4,43.4 156,42 VT7.E | 163.7,52.4 DA7.3 163.6,52.4 R28.2 158.8,52.4 158.05,51.65 | 143.2,37.7 143.2,36.2 C27.2 | 143.2,37.7 143.2,38.4 DD2.5 | 152.35,38.35 155.9,41.9 VT7.E | 152.35,38.35 150.7,36.7 153.4,34 153.8,34 154.9,32.9 VT8.E 155,33 158.7,36.7 159.3,36.7 160.1,37.5 164.7,37.5 164.9,37.7 178.5,37.7 178.95,38.15 | 143.2,37.7 146.6,37.7 147.3,38.4 152.3,38.4 152.35,38.35 | 158.05,51.65 154.4,48 154.4,45.2 154.1,44.9 154.1,43.3 154.4,43 154.7,43 155.8,41.9 VT7.E | v142.9,42.4 143.3,42.8 143.3,43.5 DD2.20 | TR5.2 115.9,56.6 106,56.6 D1.A 105.9,56.6 105.3,56 101.3,56 | 101.3,56 C28.2 | 158.05,51.65 149.9,59.8 146,59.8 144.9,58.7 144.9,57.2 143.5,55.8 JP2.6 | 95.75,45.85 97.3,44.3 98.6,45.6 98.6,46 101.3,48.7 101.3,56
  Bottom 0.254: DA1.2 18.4,7 18.2,6.8 16,6.8 14.8,8 C3.2 14.7,8.1 4,18.8 SV1.1 | 135.1,23.1 135.1,22 142.9,14.2 v142.9,11.4 142.9,11.3 143.3,10.9 v143.3,6.3 | 135.1,23.1 SV2.2 136.9,24.8 143.4,24.8 JP1.6 | C2.2 105.4,25 106,25.6 D6.A | VD2.A 66.8,24 64.8,26 C5.2 | 135.1,23.1 118.4,23.1 116,25.5 TR1.2 | C8.2 49.7,4 46.2,7.5 43.6,7.5 TR4.7 | DA10.2 18.4,38 18.2,37.8 16,37.8 14.8,39 C21.2 14.7,39.1 4,49.8 SV3.1 | VD25.A 66.8,55 64.8,57 C22.2 | C26.2 49.7,35 46.2,38.5 43.6,38.5 TR2.7 | VD22.A 234.3,46 221.7,58.6 196,58.6 VD20.A | v142.9,42.4 142.9,48.2 137.1,54 137.1,55.1 | SV4.2 137.85,55.85 | 137.85,55.85 137.1,55.1 | JP2.6 143.4,55.8 137.9,55.8 137.85,55.85 | 137.1,55.1 117.4,55.1 116,56.5 TR5.2
MISO  (via drill 0.61)
  Top 0.254: 145.25,6.95 148.9,3.3 R11.1 | 145.25,6.95 144.8,7.4 DD1.8 | 145.25,6.95 v145.6,7.3
  Bottom 0.254: v145.6,7.3 147.1,8.8 147.1,24.8 148.5,26.2 148.5,27.2 JP1.1
MISO1
  Top 0.254: DD2.8 144.8,38.5 146.1,38.5 146.8,39.2 146.8,40.2 R24.1 148.6,42.1 153.9,47.4 153.9,48.2 157.3,51.6 150.3,58.6 149.7,58.6 149.4,58.3 148.6,58.3 JP2.1
MOSI  (via drill 0.61)
  Top 0.254: DD1.9 145.6,8.2 146.1,8.2 146.3,8.4 146.3,8.7 R10.1 148.6,11.1 v146,13.7
  Bottom 0.254: v146,13.7 JP1.4
MOSI1  (via drill 0.61)
  Top 0.254: v146.3,45.9 146.3,39.4 146.1,39.2 145.6,39.2 DD2.9 | v147.6,37.5 R23.1
  Bottom 0.254: JP2.4 146,55.7 146.3,55.4 v146.3,45.9 146.3,45.8 147.6,44.5 v147.6,37.5
N$1
  Top 0.254: VD5.A 50.6,7.6 48.5,7.6 TR4.8
N$2
  Top 0.254: VD16.A 51.6,38.6 48.5,38.6 TR2.8
N$3
  Top 0.254: VT3.C 154,5.4 R13.1 155.6,7.9 160,12.3 R15.1 162.3,12.4 163.3,11.4 163.6,11.7 DA5.2 163.7,11.6 163.9,11.8 164.9,10.8 164.9,9.9 164.1,9.1 163.7,9.1 DA5.4
N$4
  Top 0.254: VT2.C 155,15.4 R12.1 156.2,16 157.5,17.3 158.6,17.3 159.9,18.6 R14.1 | R14.1 160.4,19 163.6,19 DA4.4 | DA4.2 163.6,21.6 163.2,21.6 160.7,19.1 R14.1
N$5
  Top 0.254: C17.2 244,27.9 256.4,27.9 257.3,27 VD14.A 257.3,26.9 256,25.6 VD13.C
N$6
  Top 0.254: R9.1 138.4,21.5 138.9,22 138.9,25.6 137,27.5 SV2.3 | C18.1 264,6 264,18.4 272.6,27 VD14.C
  Bottom 0.254: SV2.3 137,27.6 142.2,27.6 143,28.4 271.2,28.4 272.6,27 VD14.C
N$7
  Top 0.254: VT2.B 151.5,10.9 R10.2
N$8
  Top 0.254: VT3.B 150.5,1.9 R11.2
N$9
  Top 0.254: R18.1 177,11.6 168.4,11.6 DA5.7
N$10
  Top 0.254: R19.1 176.6,9 168.4,9 DA5.5
N$11
  Top 0.254: R17.1 176.7,19.1 168.4,19.1 DA4.5
N$12
  Top 0.254: R16.1 176.3,21.7 168.4,21.7 DA4.7
N$13
  Top 0.254: R19.2 R18.2 180.5,10.6 C14.1 184.1,10.6 184.3,10.4 190.7,10.4 191.8,11.5 195.1,11.5 VT4.1
N$14
  Top 0.254: R16.2 R17.2 180.5,20.4 C13.1 184.1,20.4 187.1,23.4 190.7,23.4 191.8,24.5 195.1,24.5 VT5.1
N$15
  Top 0.254: TR3.4 248.6,20 248.6,12.8 256,5.4 VD13.A 256.1,5.4 256.7,6 C18.2
N$16
  Top 0.254: TR3.3 243.5,20.1 243.5,23.5 244,24 C17.1
N$17
  Top 0.254: VD9.C 189.6,19.5 191.7,19.5 193.1,20.9 205.4,20.9 206.5,22 VT5.2
N$18
  Top 0.254: 22.5,13 22.5,14.6 22.1,15 VD4.A | 22.5,13 22.5,9.6 DA1.3 | TR4.4 33.5,22.4 32,22.4 22.6,13 22.5,13
N$19
  Top 0.254: R4.1 89.5,18.9 92.6,18.9 DA2.5
N$20
  Top 0.254: VD10.A 189.6,11.6 189.6,13.9 195.1,19.4 VT5.3 | VD12.C 215.4,9 219.4,13 R21.2 221.7,13 221.7,13.1 229.4,20.8 229.5,20.8 | 243.4,9 243.4,7.2 L2.1 | 243.4,9 243.4,9.9 TR3.2 | 243.4,9 C16.1 237.3,9.1 237.3,21.9 C15.2 236.9,22 235.7,20.8 229.5,20.8 | 229.5,20.9 R20.1 | 229.5,20.9 230.6,22 VD11.A | 229.5,20.8 229.5,20.9
  Bottom 0.254: VD10.A 189.6,11.5 212.8,11.5 215.3,9 VD12.C
N$21
  Top 0.254: TR3.1 248.6,9.9 248.6,7.2 L2.2
N$22
  Top 0.254: VD10.C 189.6,6.5 191.2,6.5 191.6,6.9 192.1,6.9 193.1,7.9 205.4,7.9 206.5,9 VT4.2
N$23
  Top 0.254: R3.1 89.9,16.3 92.6,16.3 DA2.7
N$24
  Top 0.254: VT7.C 155,46.4 R26.1 156.2,47 157.5,48.3 158.6,48.3 159.9,49.6 R28.1 161.4,51 163.6,51 DA7.4 163.7,51.2 164.2,51.7 164.7,51.7 165.4,52.4 164.2,53.6 163.7,53.6 DA7.2
N$25
  Top 0.254: VT8.C 154,36.4 R25.1 156.2,38 157.5,39.3 158.6,39.3 159.9,40.6 R27.1 | R27.1 160.5,40.1 163.6,40.1 DA8.4 | DA8.2 163.6,42.6 163.2,42.6 160.8,40.2 R27.1
N$26
  Top 0.254: R3.2 87.2,12.6 | 87.2,12.6 R4.2 | 87.2,12.6 87.2,9.6 VT1.1
N$27
  Top 0.254: R2.1 7,12 3,16 VD7.C
N$28  (via drill 0.61)
  Top 0.254: VD6.C 51.1,3 56.5,8.4 VD5.C 56.6,8.5 56.6,8.6 65.3,17.3 DA3.1 | 167.1,10.3 166.6,10.3 164.7,8.4 159.8,8.4 R13.2 | 167.1,10.3 168.3,10.3 DA5.6 | 167.1,18.6 167.1,19.6 167.8,20.3 168.3,20.3 DA4.6 | 169.65,16.05 170.7,15 171.7,16 C12.1 | 169.65,16.05 167.1,18.6 | R12.2 164.4,16 167,18.6 167.1,18.6 | 167.1,10.3 167.1,13.5 169.65,16.05 | v91,17.7 92.6,17.7 DA2.6 | VD1.C 68.3,27 67.3,26 C5.1 67.3,25.9 67.3,21 C6.1 67.4,19.3 65.7,17.6 DA3.1 | C4.1 58,24.7 65.4,17.3 65.6,17.5 DA3.1
  Bottom 0.254: 91,23 91,24.3 91.7,25 C2.1 | 91,23 v91,17.7 91.1,17.7 103.4,5.4 144.9,5.4 155.5,16 C12.1 | 91,23 76,23 72,27 VD1.C
N$29
  Top 0.254: 82.1,26.2 82.1,27 VD1.A | 82.1,26.2 82.1,24 VD2.C | R1.1 98.6,18.2 98.6,17.2 97.8,16.4 97.4,16.4 DA2.2 | DA2.4 97.4,18.9 99.2,18.9 R1.1 | 82.1,26.2 98.5,26.2 102.5,22.2 100,19.7 R1.1
N$30
  Top 0.254: C7.1 110,11.8 107.4,11.8 106,10.4 D6.C 105.9,10.4 101.9,10.4 98.6,7.1 VT1.2 98.5,7 93.5,2 R5.1
N$31
  Top 0.254: C10.1 R8.2 129.5,20 129.1,20.4 126.1,20.4 TR1.4
N$32
  Top 0.254: TR1.1 115.9,20.4 115.9,8.4 110,2.5 C7.2
N$33
  Top 0.254: R7.2 126.5,26 126.1,25.6 TR1.3
N$34  (via drill 0.61)
  Top 0.254: 132.4,19 R8.1 R7.1 | 132.4,19 C10.2 | 132.4,19 R9.2 135.6,21 137,22.4 SV2.1 | v144.4,10.2 145.5,10.2 DD1.13
  Bottom 0.254: v144.4,10.2 144.4,15 137,22.4 SV2.1
N$35
  Top 0.254: R2.2 16.8,7.6 17.2,8 C3.1 17.3,8.1 18.1,8.9 DA1.1
N$36
  Top 0.254: R1.2 78.6,22.4 72.2,28.8 8.8,28.8 SV1.2
N$37
  Top 0.254: L1.2 22.9,26 27.8,21.1 26.7,20 VD3.A
  Bottom 0.254: VD3.A 33.3,20 35.7,22.4 48.4,22.4 TR4.1
N$38
  Top 0.254: VD3.C 11.4,20 11.4,15.5 11.9,15 VD4.C
N$39  (via drill 0.61)
  Top 0.254: VD11.C 215.4,22 219.4,26 R20.2 221.7,26 224.5,28.8 226.8,28.8 233.6,22 C15.1 | v41.3,2 R5.2 77.7,2 v80.5,4.8
  Bottom 0.254: VD11.C 215.3,22 212.8,24.5 189.6,24.5 VD9.A 189.5,24.5 184.4,24.5 164.7,4.8 v80.5,4.8 | SV1.3 4,26.5 9.8,26.5 10,26.3 C1.1 10.1,26.2 14.9,26.2 15.1,26 L1.1 17.3,26 v41.3,2
N$40
  Top 0.254: VT8.B 150.5,32.9 R23.2
N$41
  Top 0.254: VD6.A 4.9,3 2.5,5.4 3,5.9 VD7.A
N$42
  Top 0.254: VT7.B 151.5,41.9 R24.2
N$43
  Top 0.254: R31.1 177.3,53.7 168.4,53.7 DA7.7
N$44
  Top 0.254: R32.1 168.4,51 DA7.5
N$45
  Top 0.254: R30.1 176.6,40 168.4,40 DA8.5
N$46  (via drill 0.61)
  Top 0.254: v166.8,42 167.4,42.6 168.3,42.6 DA8.7 | R29.1 v176.1,42
  Bottom 0.254: v176.1,42 v166.8,42
N$47  (via drill 0.61)
  Top 0.254: R32.2 183.6,51 C30.1 187.5,51.4 v190.1,54 | v197.6,54 200.1,56.5 VT10.1
  Bottom 0.254: v197.6,54 v190.1,54
N$48
  Top 0.254: R30.2 183.4,39 C29.1 193,38.4 194.1,39.5 VT9.1
N$49
  Top 0.254: C33.2 251,58 VD24.A 256.8,57.9 263,51.7 VD21.C
N$50
  Top 0.254: R40.1 138.4,51.5 140.9,54 140.9,57.6 139,59.5 SV4.3 | C34.1 272,37 272,57.4 272.6,58 VD24.C
  Bottom 0.254: SV4.3 139,59.5 168.3,59.5 195.4,32.4 255.4,32.4 272.6,49.6 272.6,58 VD24.C
N$51
  Top 0.254: TR6.4 256.6,45 264.1,37.5 263,36.4 VD21.A 263.7,37 C34.2
N$52
  Top 0.254: TR6.3 251.4,45.1 251.4,53.6 251,54 C33.1
N$54
  Top 0.254: VT9.3 194.2,34.5 194.2,36.2 196.4,38.4 196.4,42.9 196,43.3 VD20.C 196.5,42.9 198.2,42.9 201.3,46 VD23.A 201.5,46 209.5,54 VT10.2
  Bottom 0.254: TR6.1 256.5,34.9 252.8,34.9 250.8,32.9 230.7,32.9 219,44.6 202.8,44.6 201.4,46 VD23.A
N$56
  Top 0.254: VD19.C 192.8,32.2 200.7,32.2 205.5,37 VT9.2 205.6,37.1 214.5,46 VD23.C
N$57  (via drill 0.61)
  Top 0.254: VD17.C 52.1,34 56.5,38.4 VD16.C 56.6,38.5 56.6,39.4 65.4,48.2 DA6.1 | 167.1,50.5 167.1,51.6 167.8,52.3 168.3,52.3 DA7.6 | 167.1,50.5 171.1,46.5 C23.1 171.7,47 169.6,44.9 169.6,42.2 168.8,41.4 168.4,41.4 DA8.6 168.3,41.3 167.8,40.8 167.3,40.8 164.5,38 R25.2 158.3,38 v156.9,36.6 | R26.2 163.5,47 167,50.5 167.1,50.5 | v93.9,51.2 93.9,49.4 93.2,48.7 92.7,48.7 DA9.6 | DA6.1 65.7,48.6 67.4,50.3 C24.1 67.3,52 67.3,57 C22.1 | C20.1 58,55.7 65.4,48.3 65.6,48.5 DA6.1 | C28.1 87.2,56 83.4,59.8 74.8,59.8 73,58 VD18.C
  Bottom 0.254: v93.9,51.2 93.9,54.9 92.8,56 C28.1 93.2,55.7 94.7,57.2 98.5,57.2 119.1,36.6 v156.9,36.6 | VD18.C 68.3,58 67.3,57 C22.1
N$58
  Top 0.254: R41.1 99.1,48.7 | 99.1,48.7 97.8,47.4 97.4,47.4 DA9.2 | 99.1,48.7 97.9,49.9 97.4,49.9 DA9.4 97.3,50 96.4,50 94.5,51.9 94.4,51.9 92,54.3 83.8,54.3 83.1,55 VD25.C
  Bottom 0.254: VD25.C 83.1,55 83.1,58 VD18.A
N$59
  Top 0.254: R36.1 89.5,49.9 92.6,49.9 DA9.5
N$60
  Top 0.254: R35.1 89.9,47.3 92.6,47.3 DA9.7
N$61
  Top 0.254: R35.2 87.2,43.6 | 87.2,43.6 R36.2 | 87.2,43.6 87.2,40.6 VT6.1
N$62
  Top 0.254: C25.1 111,42.8 107.4,42.8 106,41.4 D1.C 105.9,41.4 101.9,41.4 98.6,38.1 VT6.2 98.5,38 93.5,33 R37.1
N$63
  Top 0.254: C35.1 R39.2 129.5,51.5 126.1,51.5 TR5.4
N$64
  Top 0.254: TR5.1 115.9,51.4 115.9,38.4 111,33.5 C25.2
N$65
  Top 0.254: R38.2 126.5,57 126.1,56.6 TR5.3
N$66  (via drill 0.61)
  Top 0.254: 132.4,51 R39.1 R38.1 | 132.4,51 C35.2 | 132.4,51 R40.2 135.7,51 135.7,51.1 139,54.4 SV4.1 | v144.4,41.2 145.5,41.2 DD2.13
  Bottom 0.254: v144.4,41.2 144.4,49 139,54.4 SV4.1
N$67
  Top 0.254: L3.2 22.9,58 22.9,54.7 26.6,51 VD8.A
  Bottom 0.254: VD8.A 33.3,51 35.7,53.4 48.4,53.4 TR2.1
N$68
  Top 0.254: VD8.C 11.4,51 11.4,46.5 11.9,46 VD15.C
N$69  (via drill 0.61)
  Top 0.254: v41.3,33 R37.2 77.7,33 v80.6,35.9 | v181.6,40.5 189.5,40.5 VD19.A
  Bottom 0.254: VD19.A 189.5,40.6 189.5,48.2 187.7,50 187.7,54 189.2,55.5 189.5,55.5 VD28.A | SV3.3 4,58.5 9.8,58.5 10,58.3 C19.1 10.1,58.2 14.9,58.2 15.1,58 L3.1 16.3,58 v41.3,33 | v181.6,40.5 162,40.5 157.2,35.7 130,35.7 129.8,35.9 v80.6,35.9
N$70
  Top 0.254: R41.2 94.6,52.4 92.2,54.8 85.4,54.8 83.2,57 69.4,57 66.6,59.8 7.8,59.8 SV3.2
N$71
  Top 0.254: 22.5,44 22.5,45.6 22.1,46 VD15.A | 22.5,44 22.5,40.6 DA10.3 | TR2.4 33.5,53.4 32,53.4 22.6,44 22.5,44
N$72
  Top 0.254: R42.1 3.3,48.3 3,48 VD26.C
N$73
  Top 0.254: R42.2 13.3,43 17.3,39 C21.1 17.4,39 18.2,39.8 DA10.1
N$74
  Top 0.254: VD17.A 4.9,34 2,36.9 3,37.9 VD26.A
N$76  (via drill 0.61)
  Top 0.254: v219.3,43.1 224.4,38 VT11.2 224.5,38.1 225.5,39.1 237.9,39.1 239.6,40.8 245,35.4 VD27.C
  Bottom 0.254: v219.3,43.1 201.3,43.1 194,50.4 189.6,50.4 VD28.C
N$77
  Top 0.254: VT11.3 235.9,40.6 235.9,41.5 245,50.6 VD27.A
N$78
  Top 0.254: VD22.C 221.4,46 221.4,53 222.4,54 VT12.2
N$80  (via drill 0.61)
  Top 0.254: R29.2 191.6,42 v197.6,48 | v230.4,48 233.8,51.4 VT12.1
  Bottom 0.254: v230.4,48 v197.6,48
N$81  (via drill 0.61)
  Top 0.254: v188.9,54 R31.2 | VT11.1 235.9,35.4 241.9,35.4 245.1,32.2 248.7,32.2 251.4,34.9 TR6.2
  Bottom 0.254: v188.9,54 192,50.9 228.7,50.9 241.8,37.8 248.6,37.8 251.4,35 TR6.2
RST  (1 unrouted)
  Top 0.254: 139.7,8.8 136.6,8.8 R6.1 | 139.7,8.8 140.4,8.8 DD1.31 | 139.7,8.8 139.7,23.5 143.4,27.2 JP1.5 | 139.7,39.8 137.2,39.8 R22.1 | 139.7,39.8 140.4,39.8 DD2.31 | 139.7,39.8 139.7,52.1 141.4,53.8 141.4,56.2 143.4,58.2 JP2.5
VOUT  (via drill 0.61)  (1 unrouted)
  Top 0.254: C8.1 67.3,4 67.4,4.1 C9.1 67.4,9.1 68.2,9.9 65.7,12.4 DA3.3 | 143.6,13.3 143,13.3 142.8,13.1 142.8,12.6 DD1.21 | 143.6,13.3 143.8,13.1 143.8,12.6 DD1.19 143.8,12.5 143.8,10.8 143.5,10.5 143.5,8.8 142.7,8 142.7,7.5 DD1.4 142.7,7.4 142.7,6.9 142.4,6.6 142.4,4.8 C11.1 140.1,2.5 R6.2 133.5,9 v128.4,3.9 | JP1.2 148.5,24.7 148.5,18.3 143.6,13.4 143.6,13.3 | C26.1 67.3,35 67.4,35.1 C36.1 67.4,40.1 68.2,40.9 65.7,43.4 DA6.3 | 143.6,44.3 143,44.3 142.8,44.1 142.8,43.6 DD2.21 | 143.6,44.3 143.8,44.1 143.8,43.6 DD2.19 143.8,43.5 143.8,41.8 143.5,41.5 143.5,40.5 143.2,40.2 143.2,39.7 142.7,39.2 142.7,38.5 DD2.4 142.7,38.4 142.7,36.1 C27.1 139.6,33 R22.2 133.5,39 v129.5,35 | JP2.2 148.5,55.7 148.5,49.3 143.6,44.4 143.6,44.3
  Bottom 0.254: C8.1 80.1,4 80.2,3.9 v128.4,3.9 | v129.5,35 C26.1